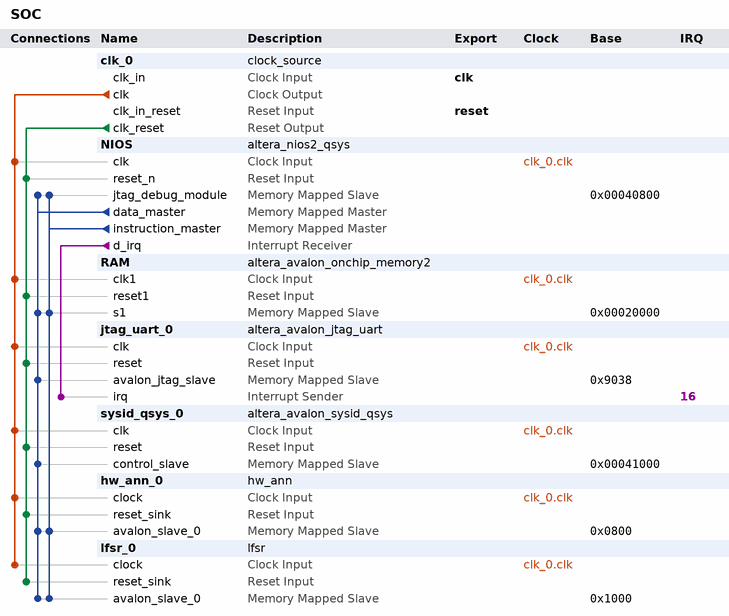
[diagram p0: system contents]
# Platform Designer (Qsys) system SOC, Cyclone IV GX EP4CGX150DF31C7
# Parameters at their usual value, and those the tool derives, are not listed.
package require -exact qsys 13.0
create_system SOC
set_project_property DEVICE_FAMILY {Cyclone IV GX}
set_project_property DEVICE EP4CGX150DF31C7

add_instance clk_0 clock_source 13.0
set_instance_parameter_value clk_0 clockFrequency 50000000

add_instance NIOS altera_nios2_qsys 13.0
set_instance_parameter_value NIOS muldiv_divider true
set_instance_parameter_value NIOS resetSlave RAM.s1
set_instance_parameter_value NIOS mmu_TLBMissExcSlave None
set_instance_parameter_value NIOS exceptionSlave RAM.s1
set_instance_parameter_value NIOS breakSlave NIOS.jtag_debug_module
set_instance_parameter_value NIOS impl Small
set_instance_parameter_value NIOS icache_size 4096

add_instance RAM altera_avalon_onchip_memory2 13.0.1.99.2
set_instance_parameter_value RAM dataWidth 32
set_instance_parameter_value RAM dualPort false
set_instance_parameter_value RAM initMemContent true
set_instance_parameter_value RAM initializationFileName onchip_mem.hex
set_instance_parameter_value RAM memorySize 131072

add_instance jtag_uart_0 altera_avalon_jtag_uart 13.0.1.99.2
set_instance_parameter_value jtag_uart_0 simInteractiveOptions NO_INTERACTIVE_WINDOWS

add_instance sysid_qsys_0 altera_avalon_sysid_qsys 13.0
set_instance_parameter_value sysid_qsys_0 id 0

add_instance hw_ann_0 hw_ann 1.0
set_instance_parameter_value hw_ann_0 Width 32
set_instance_parameter_value hw_ann_0 ConLimitador 0
set_instance_parameter_value hw_ann_0 Magnitud 7
set_instance_parameter_value hw_ann_0 Precision 24
set_instance_parameter_value hw_ann_0 Signo 1

add_instance lfsr_0 lfsr 1.0

# connections
add_connection clk_0.clk hw_ann_0.clock clock
add_connection clk_0.clk jtag_uart_0.clk clock
add_connection clk_0.clk lfsr_0.clock clock
add_connection clk_0.clk NIOS.clk clock
add_connection clk_0.clk RAM.clk1 clock
add_connection clk_0.clk sysid_qsys_0.clk clock
add_connection clk_0.clk_reset hw_ann_0.reset_sink reset
add_connection clk_0.clk_reset jtag_uart_0.reset reset
add_connection clk_0.clk_reset lfsr_0.reset_sink reset
add_connection clk_0.clk_reset NIOS.reset_n reset
add_connection clk_0.clk_reset RAM.reset1 reset
add_connection clk_0.clk_reset sysid_qsys_0.reset reset
add_connection NIOS.data_master hw_ann_0.avalon_slave_0 avalon
set_connection_parameter_value NIOS.data_master/hw_ann_0.avalon_slave_0 baseAddress 0x0800
add_connection NIOS.data_master jtag_uart_0.avalon_jtag_slave avalon
set_connection_parameter_value NIOS.data_master/jtag_uart_0.avalon_jtag_slave baseAddress 0x9038
add_connection NIOS.data_master lfsr_0.avalon_slave_0 avalon
set_connection_parameter_value NIOS.data_master/lfsr_0.avalon_slave_0 baseAddress 0x1000
add_connection NIOS.data_master NIOS.jtag_debug_module avalon
set_connection_parameter_value NIOS.data_master/NIOS.jtag_debug_module baseAddress 0x00040800
add_connection NIOS.data_master RAM.s1 avalon
set_connection_parameter_value NIOS.data_master/RAM.s1 baseAddress 0x00020000
add_connection NIOS.data_master sysid_qsys_0.control_slave avalon
set_connection_parameter_value NIOS.data_master/sysid_qsys_0.control_slave baseAddress 0x00041000
add_connection NIOS.instruction_master hw_ann_0.avalon_slave_0 avalon
set_connection_parameter_value NIOS.instruction_master/hw_ann_0.avalon_slave_0 baseAddress 0x0800
add_connection NIOS.instruction_master lfsr_0.avalon_slave_0 avalon
set_connection_parameter_value NIOS.instruction_master/lfsr_0.avalon_slave_0 baseAddress 0x1000
add_connection NIOS.instruction_master NIOS.jtag_debug_module avalon
set_connection_parameter_value NIOS.instruction_master/NIOS.jtag_debug_module baseAddress 0x00040800
add_connection NIOS.instruction_master RAM.s1 avalon
set_connection_parameter_value NIOS.instruction_master/RAM.s1 baseAddress 0x00020000
add_connection NIOS.d_irq jtag_uart_0.irq interrupt
set_connection_parameter_value NIOS.d_irq/jtag_uart_0.irq irqNumber 16

# exported interfaces
add_interface clk clock sink
set_interface_property clk EXPORT_OF clk_0.clk_in
add_interface reset reset sink
set_interface_property reset EXPORT_OF clk_0.clk_in_reset

set_interconnect_requirement {$system} qsys_mm.clockCrossingAdapter HANDSHAKE
set_interconnect_requirement {$system} qsys_mm.maxAdditionalLatency 1

save_system SOC.qsys
